# EAGLE design GBC USB-C Charging Kit (EAGLE 6.2)
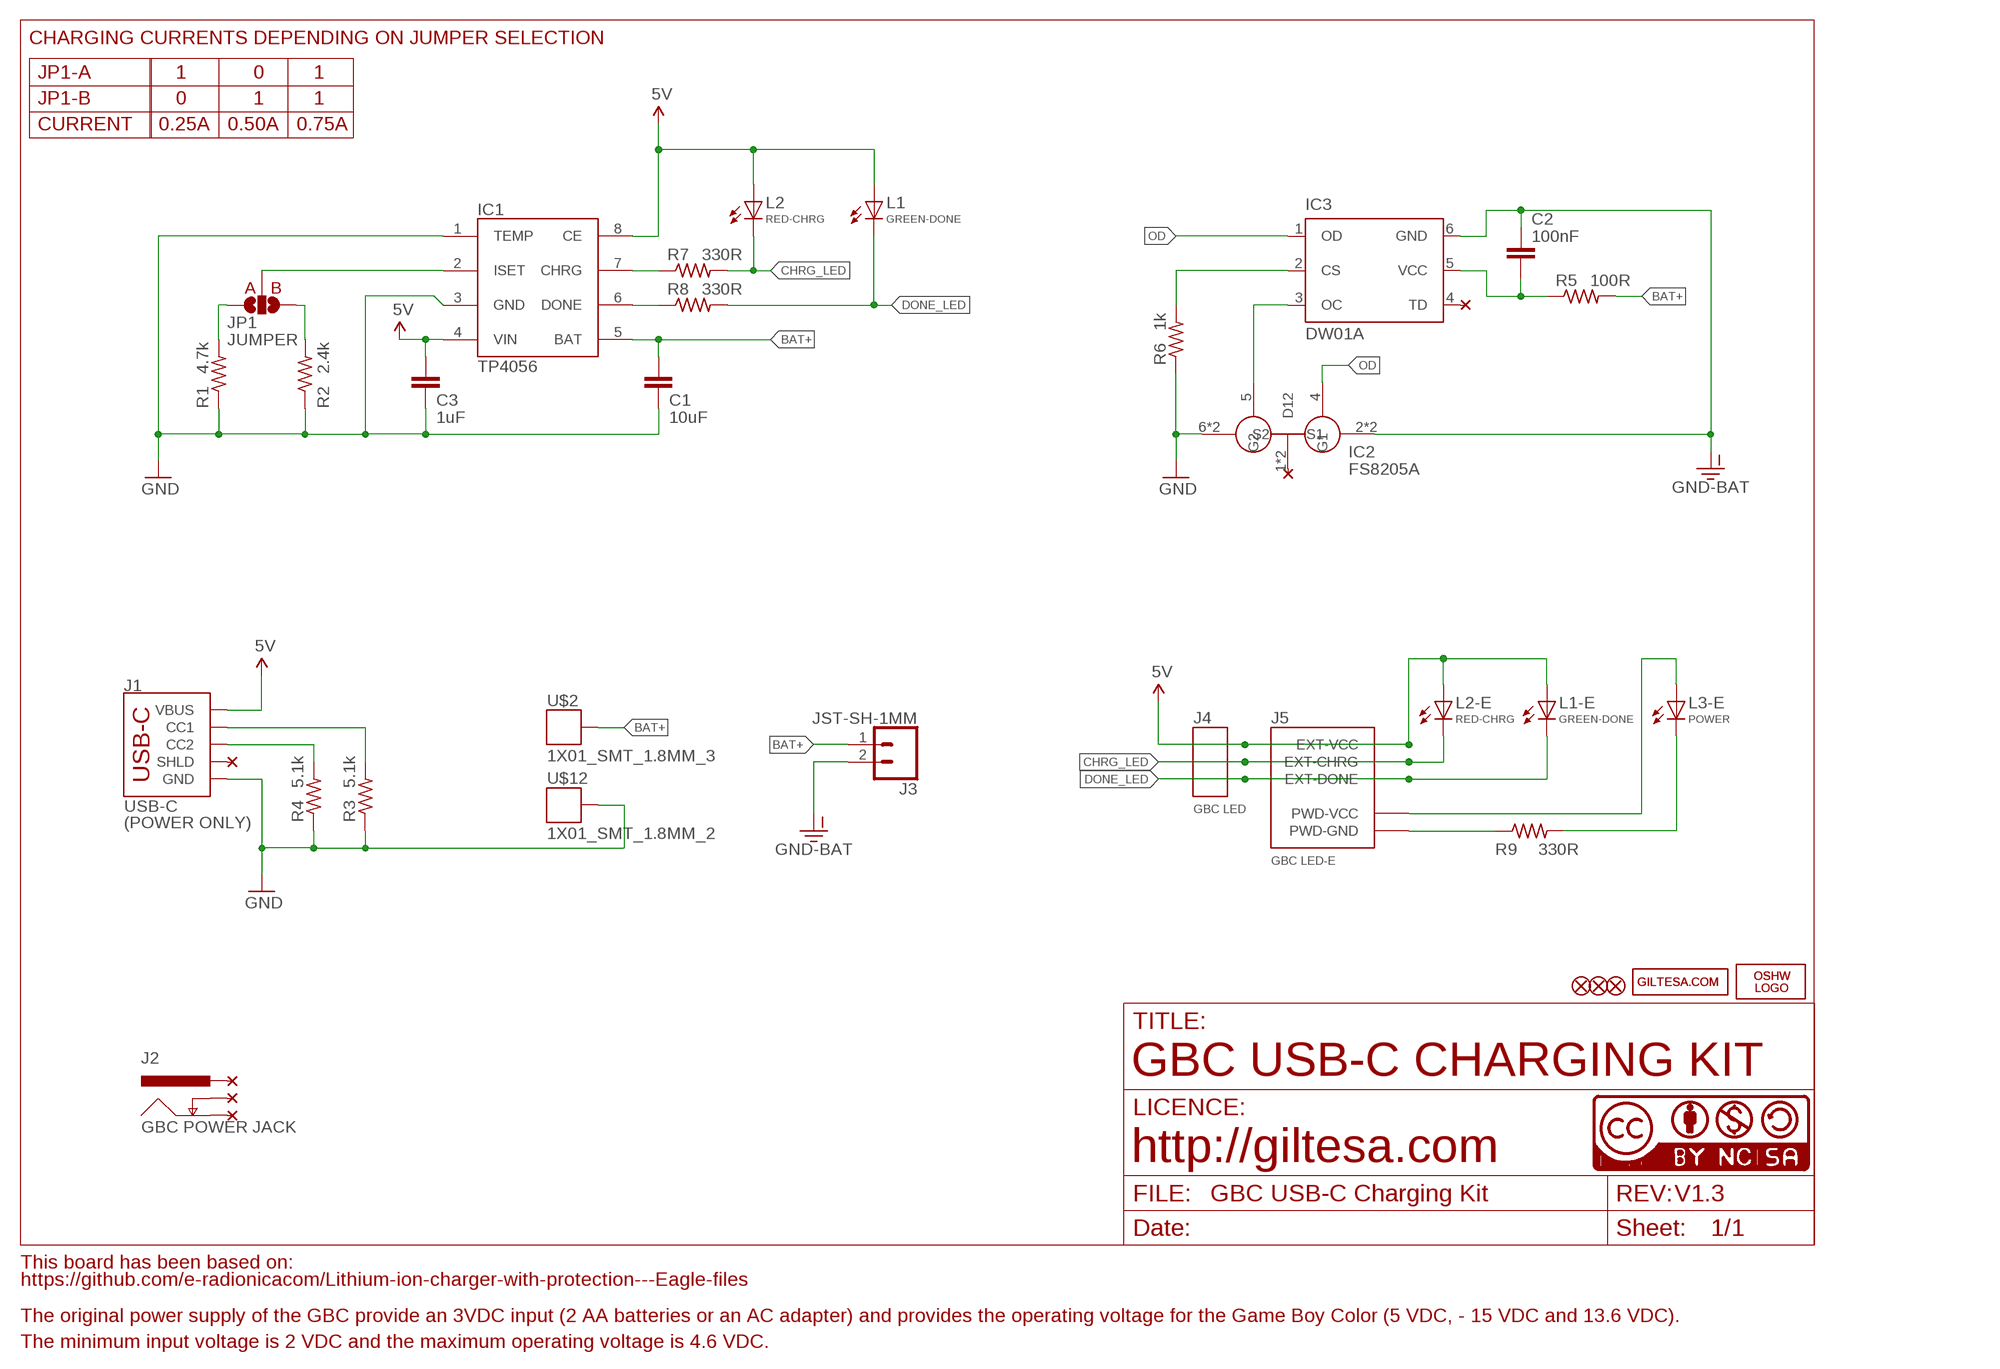
[diagram p0: schematic, sheet 1]

## Parts
C1  10uF  C0805  [C0805]
C2  100nF  C0603  [C0603]
C3  1uF  C0603  [C0603]
FD2  FIDUCIALUFIDUCIAL  [FIDUCIAL-MICRO]
FD3  FIDUCIALUFIDUCIAL  [FIDUCIAL-MICRO]
FD4  FIDUCIALUFIDUCIAL  [FIDUCIAL-MICRO]
IC1  TP4056  DIO5158  [SOIC-8]
IC2  8205A  FS8205A  [TSSOP8]
IC3  DW01A  DW01-P  [SOT23-6L]
J1  USB-C  USB-CPOWER  [USB-C_6P]
J2  GBC POWER JACK  GBC_POWER_JACK2  [GBC_POWER_JACK_2]
J3  JST-SH-1MM  JST-21MM  [JST-2-1MM-SMD_RIGHT]
J4  GBC LED  1X032  [1X03_SMD_2]
J5  GBC LED-E  GBC_LED  [GBC_LED]
JP1  JUMPER  JUMPER-SMD-3_NO  [JUMPER-SMD-3_NO_SILK]
L1  GREEN-DONE  L0402  [L0402]
L1-E  GREEN-DONE  L0402  [L0402]
L2  RED-CHRG  L0402  [L0402]
L2-E  RED-CHRG  L0402  [L0402]
L3-E  POWER  L0402  [L0402]
LOGO1  OSHW_LOGO_FILLX0150-NT  [OSHW_FILLX150_NOTEXT]
LOGO2  OSHW_LOGO_FILLX0150-NT  [OSHW_FILLX150_NOTEXT]
R1  4.7k  R0402  [R0402]
R2  2.4k  R0402  [R0402]
R3  5.1k  R0402  [R0402]
R4  5.1k  R0402  [R0402]
R5  100R  R0402  [R0402]
R6  1k  R0402  [R0402]
R7  330R  R0402  [R0402]
R8  330R  R0402  [R0402]
R9  330R  R0402  [R0402]
U$2  1X01_SMT_1.8MM_3  [1X01_SMT_1.8MM_3]
U$6  CC-BY-NC-SA15MM  [CC-BY-NC-SA_15MM]
U$10  GILTESA.COM_MASK  [GILTESA.COM_MASK]
U$12  1X01_SMT_1.8MM_2  [1X01_SMT_1.8MM_2]
U$16  GILTESA.COM_MASK  [GILTESA.COM_MASK]
U$17  CC-NC-BCNIX  [CC-NC-B_NIX]

## Nets
5V: C3.1 IC1.4(VIN) IC1.8(CE) J1.VBUS1(VBUS) J1.VBUS2(VBUS) J4.3 J5.EXT-VCC L1-E.A L1.A L2-E.A L2.A
BAT+: C1.1 IC1.5(BAT) J3.1 R5.2 U$2.P$1
CHRG: IC1.7(CHRG) R7.1
CHRG_LED: J4.2 J5.EXT-CHRG L2-E.C L2.C R7.2
DONE: IC1.6(DONE) R8.1
DONE_LED: J4.1 J5.EXT-DONE L1-E.C L1.C R8.2
GND: C1.2 C3.2 IC1.1(TEMP) IC1.3(GND) IC2.6(S2) IC2.7(S2) J1.GND1(GND) J1.GND2(GND) R1.1 R2.1 R3.1 R4.1 R6.1 U$12.P$1
GND-BAT: C2.1 IC2.2(S1) IC2.3(S1) IC3.6(GND) J3.2
ISET: IC1.2(ISET) JP1.2
N$1: IC3.2(CS) R6.2
N$2: IC2.5(G2) IC3.3(OC)
N$4: J1.B5(CC2) R4.2
N$8: JP1.3 R2.2
N$9: JP1.1 R1.2
N$10: J5.PWD-VCC L3-E.A
N$11: L3-E.C R9.2
N$12: J5.PWD-GND R9.1
N$13: J1.A5(CC1) R3.2
OD: IC2.4(G1) IC3.1(OD)
VCC-DW: C2.2 IC3.5(VCC) R5.1
Unconnected: IC2.1(D12) IC2.8(D12) IC3.4(TD) J1.SHLD1(SHLD) J1.SHLD2(SHLD) J1.SHLD3(SHLD) J1.SHLD4(SHLD) J1.SHLD5(SHLD) J1.SHLD6(SHLD) J1.SHLD7(SHLD) J1.SHLD8(SHLD) J2.P$1(PWR) J2.P$2(GND) J2.P$3(GNDBREAK)

## Notes on the sheet
- CHARGING CURRENTS DEPENDING ON JUMPER SELECTION
- JP1-A | 1 | 0 | 1
- JP1-B | 0 | 1 | 1
- CURRENT | 0.25A | 0.50A | 0.75A
- A | B
- IC2
- FS8205A
- (POWER ONLY)
- GBC USB-C CHARGING KIT
- http://giltesa.com
- V1.3
- This board has been based on:
- https://github.com/e-radionicacom/Lithium-ion-charger-with-protection---Eagle-files
- The original power supply of the GBC provide an 3VDC input (2 AA batteries or an AC adapter) and provides the operating voltage for the Game Boy Color (5 VDC, - 15 VDC and 13.6 VDC).
- The minimum input voltage is 2 VDC and the maximum operating voltage is 4.6 VDC.

## Library data of the parts
C1 = ,giltesa:C0805
C2 C3 = ,giltesa:C0603
FD2-FD4 = SparkFun-Aesthetics:FIDUCIAL: Fiducial Alignment Points Point-of-reference for pick-and-place machines and other optical instruments.
IC1 = ERADIONICA:DIO5158
IC2 = SparkFun:FS8205A
IC3 = lipo:DW01-P: One Cell Lithium-ion/Polymer Battery Protection IC The DW01-P battery protection IC is designed to protect lithium-ion/polymer battery from damage or degrading the lifetime due to overcharge, overdischarge, and/or overcurrent for one-cell lithium-ion/polymer battery powered systems, such as cellular phones. The ultra-small package and less required external components make it ideal to integrate the DW01-P into the limited space of battery pack. The accurate ±50mV overcharging detection voltage ensures safe and full utilization charging. The very low standby current drains little current from the cell while in storage.
J1 = ,giltesa:USB-C
J2 = ,giltesa:GBC_POWER_JACK
J3 = ,giltesa:JST-2
J4 = ,giltesa:1X03
J5 = ,giltesa:GBC_LED
JP1 = ,giltesa:JUMPER-SMD-3_NO
L1 L1-E L2 L2-E L3-E = ,giltesa:L0402
LOGO1 LOGO2 = ohw-logo:OSHW_LOGO_FILL
R1-R9 = ,giltesa:R0402
U$2 U$12 = ,giltesa:1X01
U$6 = ,giltesa_logos:CC-BY-NC-SA
U$10 U$16 = ,giltesa_logos:GILTESA.COM
U$17 = cc-by-nc-sa:CC-NC-BC: All hardware is licensed under the Creative Commons Attribution-Noncommercial-Share Alike 2.5 Switzerland License. To view a copy of this license, visit http://creativecommons.org/licenses/by-nc-sa/2.5/ch/ or send a letter to Creative Commons, 171 Second Street, Suite 300, San Francisco, California, 94105, USA.

## Net classes
1 power: width 0.61 mm, drill 0.406 mm, clearance 0.203 mm
2 gnd: width 0.305 mm, drill 0.406 mm, clearance 0.203 mm
3 power usb: width 0.508 mm, drill 0.406 mm, clearance 0.203 mm

## Board
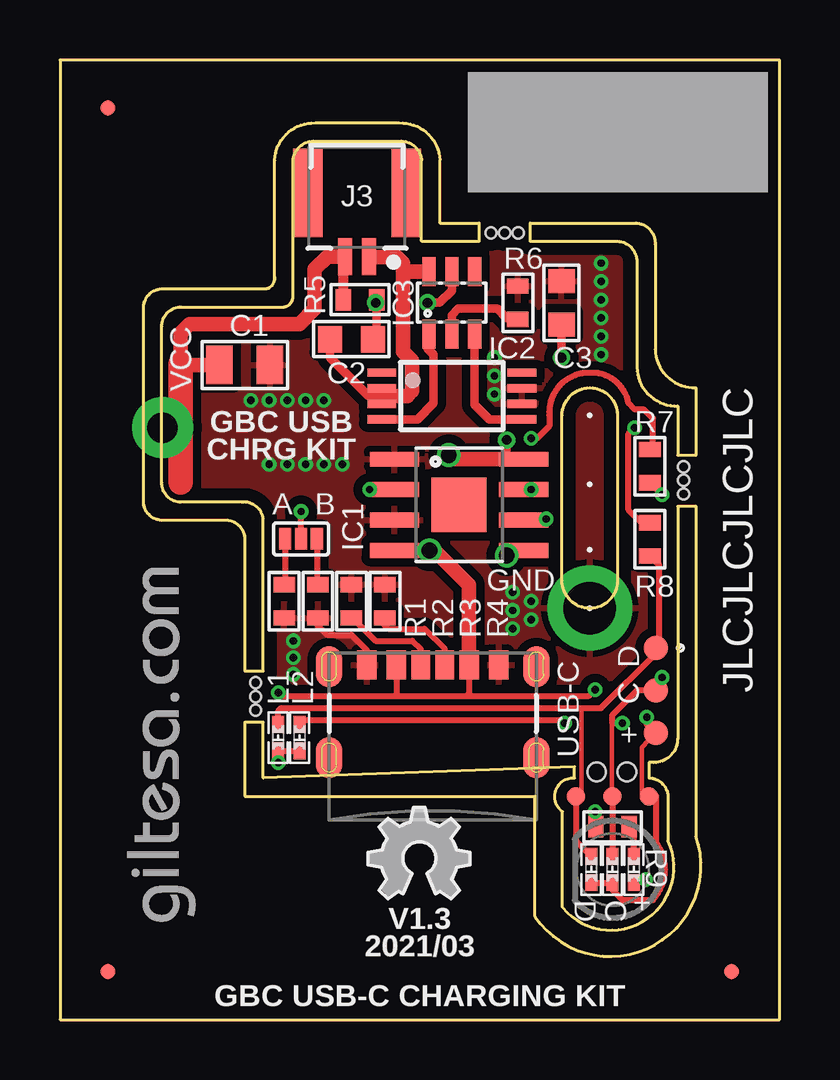
[diagram p1: board, top side]
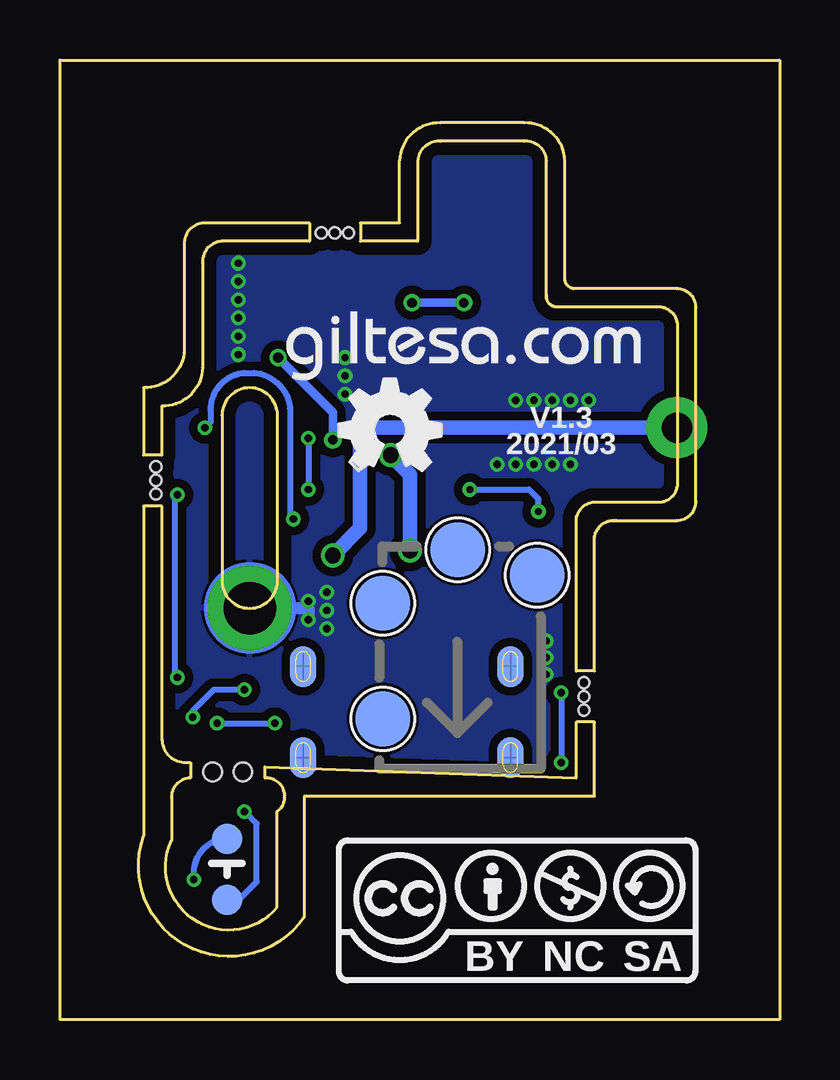
[diagram p2: board, bottom side, seen from below]

Size 30 x 40 mm. Coordinates in mm from the lower left corner, seen from the top.
Outline: 7.71,9.3 7.71,12.4 8.47,12.4 8.47,10.07 21.45,10.54 21.45,10.07 arc149 20.95,8.67 20.95,4.67 arc165 25.35,7.47 25.35,9.27 arc90 24.55,10.07 24.55,10.71 24.75,10.71 arc90 25.75,11.71 25.75,21.4 26.52,21.4 26.52,7.65 arc-165 19.81,4.29 19.81,9.3 7.7,9.3
Outline: 23.24,25.18 23.24,18.3 arc-180 20.93,18.3 20.93,25.18 arc-180 23.24,25.18
Outline: 8.47,14.53 8.47,20.87 arc90 7.57,21.57 5.05,21.57 arc-90 4.25,22.37 4.25,28.9 arc-90 5.05,29.7 9.34,29.7 arc90 9.71,30.2 9.71,35.81 arc-90 10.64,36.61 14.15,36.61 arc-90 15.08,35.81 15.08,32.44 17.47,32.44 17.47,33.2 15.84,33.2 15.84,35.81 arc90 14.15,37.38 10.64,37.38 arc90 8.95,35.81 8.95,30.96 arc-90 8.58,30.46 4.28,30.46 arc90 3.48,29.66 3.48,21.61 arc90 4.28,20.8 6.81,20.8 arc-90 7.71,20.11 7.71,14.53 8.47,14.53
Outline: 19.6,32.44 23.25,32.44 arc-90 24.05,31.54 24.05,27.18 arc90 25.75,25.57 25.75,23.53 26.52,23.53 26.52,26.34 arc-90 24.82,27.94 24.82,32.3 arc90 24.02,33.2 19.6,33.2 19.6,32.44
Outline: 0,0 30,0 30,40 0,40 0,0
Copper layers (1*16): Top 0.035mm / dielectric 1.6mm / Bottom 0.035mm
Design rules: minimum track width 6mil, minimum drill 12mil, track to track 6mil, track to pad 6mil, pad to pad 6mil, via to via 8mil, smd to smd 0mil, copper to edge 20mil, drill to drill 10mil, minimum pad ring 6mil, minimum via ring 6mil, stop-mask expansion 0mil, vias tented up to drill 100mil, thermal gap 10mil
Holes 0.76 mm at 22.38,10.32 23.63,10.32
Holes 0.46 mm at 8.16,14.04 8.16,12.89 8.16,13.47 26.01,21.9 26.01,23.05 26.01,22.48 17.97,32.79 19.11,32.79 18.54,32.79
Milling: 4 lines

### Footprints (pad centres in the part's own frame; a part is rotated, then mirrored left to right if it is on the bottom)
C0805 = smd 1.1 x 1.6: 1 -1.05,0; 2 1.05,0
C0603 = smd 1 x 1.1: 1 -0.901,0; 2 0.901,0
FIDUCIAL-MICRO = smd 0.635 x 0.635: 1 0,0
SOIC-8 = smd 0.61 x 2.057: 1 -2.07,-2.892; 2 -0.8,-2.892; 3 0.47,-2.892; 4 1.74,-2.892; 5 1.74,2.492; 6 0.47,2.492; 7 -0.8,2.492; 8 -2.07,2.492 | smd 2.286 x 2.286: EPAD -0.165,-0.2
TSSOP8 = smd 1.2 x 0.35: 1 -2.925,0.975; 2 -2.925,0.325; 3 -2.925,-0.325; 4 -2.925,-0.975; 5 2.925,-0.975; 6 2.925,-0.325; 7 2.925,0.325; 8 2.925,0.975
SOT23-6L = smd 0.55 x 1.2: 1 -0.95,-1.3; 2 0,-1.3; 3 0.95,-1.3; 4 0.95,1.3; 5 0,1.3; 6 -0.95,1.3
USB-C_6P = smd 0.76 x 1.2: A5 -0.5,-0.08; B5 0.5,-0.08 | smd 0.8 x 1.2: GND1 -2.75,-0.08; GND2 2.75,-0.08; VBUS1 -1.52,-0.08; VBUS2 1.52,-0.08 | smd 1.1 x 1.7: SHLD1 -4.32,-0.15; SHLD2 4.32,-0.15; SHLD5 -4.32,-3.95; SHLD8 4.32,-3.95 | smd 1.1 x 1.7 bottom: SHLD3 -4.32,-0.15; SHLD4 4.32,-0.15; SHLD6 -4.32,-3.95; SHLD7 4.32,-3.95
GBC_POWER_JACK_2 = smd 2.286 x 2.286 bottom: P$1 5.232,10.16; P$2 8.357,7.925; P$3 1.93,9.093; P$4 8.357,3.099
JST-2-1MM-SMD_RIGHT = smd 0.6 x 1.55: 1 -0.5,-2.017; 2 0.5,-2.017 | smd 1.219 x 3.683: NC1 -2.054,0.635; NC2 2.054,0.635
1X03_SMD_2 = smd 1.016 x 1.016: 1 0,-1.778; 2 0,0; 3 0,1.778
GBC_LED = smd 0.762 x 0.762: EXT-CHRG -3.048,0; EXT-DONE -3.048,-1.524; EXT-VCC -3.048,1.524 | smd 1.27 x 1.27 bottom: PWD-GND 1.27,0; PWD-VCC -1.27,0
JUMPER-SMD-3_NO_SILK = smd 0.508 x 0.889: 1 -0.66,0; 2 0,0; 3 0.66,0
L0402 = smd 0.7 x 0.5: A -0.55,0; C 0.55,0
R0402 = smd 0.635 x 0.9: 1 -0.694,0; 2 0.694,0
1X01_SMT_1.8MM_3 = drill 1.27 pad 2.54: P$1 0,0
1X01_SMT_1.8MM_2 = drill 2.184 pad 3.556: P$1 0,0

### Placement (x,y rotation side)
C1  7.7,27.29 0 top
C2  12.15,28.36 0 top
C3  20.91,29.88 90 top
FD2  2,38 0 top
FD3  28,2 0 top
FD4  2,2 0 top
IC1  16.84,21.29 270 top
IC2  16.34,25.99 0 top
IC3  16.34,29.88 0 top
J1  15.54,14.87 0 top
J2  8.18,9.43 0 top
J3  12.38,33.82 0 top
J4  24.85,13.72 180 top
J5  23.04,6.26 270 top
JP1  10.05,20.04 0 top
L1  9.1,11.75 90 top
L1-E  22.15,6.26 90 top
L2  9.99,11.75 90 top
L2-E  23.04,6.26 90 top
L3-E  23.93,6.26 90 top
LOGO1  18.37,22.89 0 bottom
LOGO2  12.85,5.03 0 top
R1  9.35,17.43 90 top
R2  10.75,17.43 90 top
R3  12.15,17.43 270 top
R4  13.54,17.43 270 top
R5  12.51,30.01 180 top
R6  19.09,29.88 270 top
R7  24.59,23.07 270 top
R8  24.59,20.02 270 top
R9  23.04,8.04 0 top
U$2  4.27,24.67 0 top
U$6  18.5,1.5 0 bottom
U$10  20.65,26.58 0 bottom
U$12  22.09,17.15 0 top
U$16  5.73,3.98 90 top
U$17  0,0 0 top

### Tracks (layer width: path | path; a pad name or v marks a point on that pad's centre or on a via)
5V  (via drill 0.3, 0.41, 0.66)
  Top 0.178: 24.56,9.34 24.26,9.38 24.26,11.34 24.82,11.94
  Top 0.254: L1-E.A L2-E.A 23.04,5.4 23.45,4.99 24.72,4.99 arc80 24.85,7.4 24.85,9.3 24.72,9.18 J5.EXT-VCC 24.56,9.34 | L2.A L1.A v9.1,10.7 | 24.82,11.94 J4.3 24.47,12.32 v24.47,12.61 | v9.1,13.62 9.23,13.5 14.05,13.5 | 14.05,13.5 16.97,13.5 | 16.97,13.5 22.05,13.5 v22.31,13.75 | 16.97,13.5 17.06,13.59 J1.VBUS2 | J1.VBUS1 14.02,13.53 14.05,13.5
  Top 0.356: 19.05,23.36 18.62,23.4 v18.62,24.16 | v20.91,27.59 C3.1
  Top 0.61: IC1.4 v15.41,19.55 15.62,19.55 17.06,18.11 J1.VBUS2 | IC1.8 19.05,23.36 16.38,23.36 v16.21,23.53
  Bottom 0.254: v9.1,13.62 v9.1,10.7 | v22.31,13.75 23.58,13.75 24.47,12.86 v24.47,12.61
  Bottom 0.356: v18.62,24.16 18.62,25.31 v20.91,27.59
  Bottom 0.61: v15.41,19.55 15.41,22.73 v16.21,23.53
BAT+  (via drill 0.66)
  Top 0.406: R5.2 11.82,31.73 J3.1
  Top 0.61: C1.1 5.09,27.29 5.04,27.34 5.04,28.61 5.42,28.99 9.99,28.99 10.62,29.62 10.62,31.28 11.15,31.8 J3.1 | IC1.5 18.84,19.55 v18.62,19.34 | 5.04,23.91 U$2.P$1
  Top 1.016: 5.04,27.34 5.04,23.91 5.04,22.39
  Bottom 0.61: U$2.P$1 17.1,24.67 17.48,24.29 17.48,20.48 v18.62,19.34
CHRG  (via drill 0.3)
  Top 0.254: R7.1 24.72,23.89 24.72,25.05 24.34,25.43 23.96,25.43 23.7,25.69 arc75 22.31,26.96 21.93,26.96 arc90 20.4,25.18 20.4,24.74 19.89,24.23 v19.64,24.23 | v19.64,22.09 19.64,22.04 IC1.7
  Bottom 0.254: v19.64,24.23 v19.64,22.09
CHRG_LED  (via drill 0.3)
  Top 0.178: 23.04,12.35 23.01,12.35 23.01,9.34 J5.EXT-CHRG
  Top 0.254: J5.EXT-CHRG L2-E.C | v25.1,14.26 25.1,14 24.85,13.75 J4.2 24.05,13.72 23.04,12.7 23.04,12.35 v23.45,12.35 | v25.1,21.88 25.09,21.88 R7.2 | 9.99,12.35 L2.C 10.04,12.35 10.04,12.41 10.12,12.48 20.91,12.48 v21.04,12.35
  Bottom 0.254: v25.1,21.88 25.23,21.75 25.23,14.38 v25.1,14.26 | v23.45,12.35 v21.04,12.35
DONE  (via drill 0.3)
  Top 0.254: R8.1 24.24,20.71 23.7,21.24 23.7,24.42 v23.96,24.67 | IC1.6 20.23,20.82 v20.27,20.86
  Bottom 0.254: v23.96,24.67 23.7,24.93 23.7,25.31 arc90 22.31,26.96 21.93,26.96 arc90 20.4,25.18 20.4,20.99 v20.27,20.86
DONE_LED
  Top 0.178: 21.51,9.4 21.75,9.51 21.75,12.99
  Top 0.254: L1-E.C 21.51,7.44 J5.EXT-DONE 21.51,9.4 | 24.59,15.75 J4.1 | J4.1 24.82,15.24 22.56,12.99 21.75,12.99 9.23,12.99 9.1,12.86 L1.C | R8.2 24.61,19.32 24.97,18.96 24.97,15.62 J4.1
GND  (via drill 0.3)
  Top 0.254: R2.1 10.75,16.42 11.13,16.04 12.15,16.04 12.79,15.39 J1.GND1
  Bottom 0.508: 22.05,17.15 19.64,17.15 v19.64,16.67
  Bottom 3.81: U$12.P$1 22.05,17.15
  other vias: 9.73,15.78 9.73,15.08 9.73,14.39 19.64,17.43 18.88,17.05 18.88,17.81 18.88,16.29 18.12,27.59 18.12,26.83 18.12,26.07 7.96,25.82 8.72,25.82 9.48,25.82 10.24,25.82 11,25.82 11.77,23.15 11,23.15 10.24,23.15 9.48,23.15 8.72,23.15 22.56,29.24 22.56,31.53 22.56,30.77 22.56,28.48 22.56,30.01 22.56,27.72
  pour Top (isolate 0.356): 3.63,37.37 26.49,37.37 26.49,9.43 3.63,9.43
  pour Bottom (isolate 0.356): 3.63,37.37 26.49,37.37 26.49,9.43 3.63,9.43
GND-BAT
  Top 0.305: IC2.3 13.41,25.99 | IC2.2 13.41,25.99 | 13.41,25.99 13.21,25.99
  Top 0.356: 13.21,25.99 12.86,25.99 11.26,27.59 11.26,28.35 C2.1
  Top 0.508: IC3.6 15.22,31.18
  Top 0.61: 13.41,25.99 14.48,25.99 14.69,26.2 14.69,27.47 14.31,27.85 14.31,31.28 | 14.31,31.28 14.31,31.53 14.05,31.78 12.9,31.78 J3.2 | 15.22,31.18 14.4,31.18 14.31,31.28
ISET  (via drill 0.3)
  Top 0.254: JP1.2 v10.05,21.18 | v12.91,22.09 13.86,22 IC1.2
  Bottom 0.254: v12.91,22.09 10.46,22.09 10.05,21.69 v10.05,21.18
N$1
  Top 0.356: IC3.2 16.34,29.37 16.59,29.62 18.24,29.62 18.62,29.24 19.03,29.24 R6.2
N$2
  Top 0.356: IC3.3 17.29,25.63 17.9,25.02 IC2.5
N$4
  Top 0.254: R4.2 13.54,16.42 13.67,16.29 15.2,16.29 16.04,15.44 J1.B5
N$8
  Top 0.254: 10.86,18.24 R2.2 10.71,18.17 JP1.3
N$9
  Top 0.254: 9.24,18.24 R1.2 9.39,18.17 JP1.1
N$10  (via drill 0.3)
  Top 0.254: L3-E.A arc-90 24.05,5.83 v24.42,5.83
  Bottom 0.254: J5.PWD-VCC arc-90 24.42,6.14 v24.42,5.83
N$11
  Top 0.254: L3-E.C 23.93,7.84 R9.2
N$12  (via drill 0.3)
  Top 0.254: v22.31,8.67 22.31,8.07 R9.1
  Bottom 0.254: v22.31,8.67 21.8,8.16 21.8,5.75 22.56,4.99 J5.PWD-GND
N$13
  Top 0.254: R3.2 12.21,16.74 13.16,15.78 14.69,15.78 15.04,15.43 J1.A5
OD
  Top 0.356: IC2.4 14.91,25.02 15.58,25.69 15.58,27.72 15.32,27.97 15.32,28.51 IC3.1
VCC-DW  (via drill 0.41)
  Top 0.356: C2.2 13.21,28.51 R5.1 v13.16,29.88 | v15.32,29.88 15.83,29.88 16.34,30.39 IC3.5
  Bottom 0.356: v13.16,29.88 v15.32,29.88

### Text on the board
tPlace: VCC | GBC USB | CHRG KIT | A | B | JLCJLCJLCJLC | GND | D | C | + | D | C | + | V1.3 | 2021/03 | GBC USB-C CHARGING KIT
bPlace: V1.3 | 2021/03